# Altium schematic sheet MCU.SchDoc: Top Level
size A3; CompanyName: NOT USED; SheetNumber: 0; SheetTotal: 0; PageSetup: Record=PageOptions|CenterHorizontal=True|CenterVertical=True|PrintScale=1.00|XCorrection=1.00|YCorrection=1.00|PrintKind=0|BorderSize=5000000|LeftOffset=0|BottomOffset=0|Orientation=2|PaperLength=1000|PaperWidth=1000|Scale=100|PaperSource=7|PrintQuality=-4|MediaType=1|DitherType=10|PaperKind=A3|PrintScaleMode=0
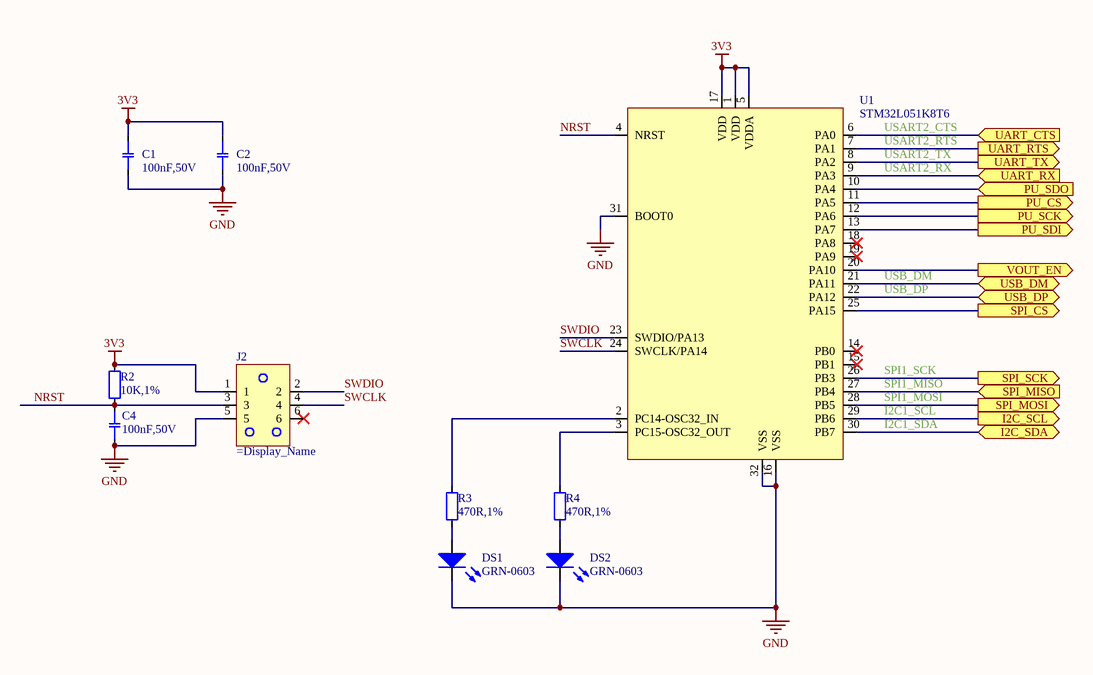
[diagram p0: MCU.SchDoc]

## Parts
C1  100nF,50V  [CAPC1608X09N_0603]
C2  100nF,50V  [CAPC1608X09N_0603]
C4  100nF,50V  [CAPC1608X09N_0603]
DS1  GRN-0603  [LED_SML-LX0603]
DS2  GRN-0603  [LED_SML-LX0603]
J2  (no value)  [TAG-CONNECT_TC2030-IDC]  (no BOM)
R2  10K,1%  [RESC1608X06N_0603]
R3  470R,1%  [RESC1608X06N_0603]
R4  470R,1%  [RESC1608X06N_0603]
U1  STM32L051K8T6  [LQFP32]

## Ports
I2C_SCL (out), I2C_SDA (bidir), PU_CS (out), PU_SCK (out), PU_SDI (out), PU_SDO (in), SPI_CS (out), SPI_MISO (in), SPI_MOSI (out), SPI_SCK (out), UART_CTS (in), UART_RTS (out), UART_RX (in), UART_TX (out), USB_DM (bidir), USB_DP (bidir), VOUT_EN (out)

## Nets
3V3: C1.2 C2.2 J2.1 R2.2 U1.1(VDD) U1.5(VDDA) U1.17(VDD)
GND: C1.1 C2.1 C4.2 DS1.1(C) DS2.1(C) J2.5 U1.16(VSS) U1.31(BOOT0) U1.32(VSS)
I2C_SCL: U1.29(PB6) ; port I2C_SCL
I2C_SDA: U1.30(PB7) ; port I2C_SDA
NRST: C4.1 J2.3 R2.1 U1.4(NRST)
PU_CS: U1.11(PA5) ; port PU_CS
PU_SCK: U1.12(PA6) ; port PU_SCK
PU_SDI: U1.13(PA7) ; port PU_SDI
PU_SDO: U1.10(PA4) ; port PU_SDO
SPI_CS: U1.25(PA15) ; port SPI_CS
SPI_MISO: U1.27(PB4) ; port SPI_MISO
SPI_MOSI: U1.28(PB5) ; port SPI_MOSI
SPI_SCK: U1.26(PB3) ; port SPI_SCK
SWCLK: J2.4 U1.24(SWCLK/PA14)
SWDIO: J2.2 U1.23(SWDIO/PA13)
UART_CTS: U1.6(PA0) ; port UART_CTS
UART_RTS: U1.7(PA1) ; port UART_RTS
UART_RX: U1.9(PA3) ; port UART_RX
UART_TX: U1.8(PA2) ; port UART_TX
USB_DM: U1.21(PA11) ; port USB_DM
USB_DP: U1.22(PA12) ; port USB_DP
VOUT_EN: U1.20(PA10) ; port VOUT_EN
NetDS1_2: DS1.2(A) R3.1
NetDS2_2: DS2.2(A) R4.1
NetR3_2: R3.2 U1.2(PC14-OSC32_IN)
NetR4_2: R4.2 U1.3(PC15-OSC32_OUT)

Not connected (* = marked no-connect by the designer): J2 6*; U1 14(PB0)* 15(PB1)* 18(PA8)* 19(PA9)*

## Notes on the sheet
- (near U1) USART2_CTS
- (near U1) USART2_RTS
- (near U1) USART2_TX
- (near U1) USART2_RX
- (near U1) USB_DM
- (near U1) USB_DP
- (near U1) SPI1_SCK
- (near U1) SPI1_MISO
- (near U1) SPI1_MOSI
- (near U1) I2C1_SCL
- (near U1) I2C1_SDA
- Project
- Size:
- Date:
- A3
- Revision:
- Sheet
- of
- Lambo
- File:

## Library data of the parts
C1 C2 C4 = CCH-104CH-G: CAP CER 0.1UF 50V 10% X7R 0603; Manufacturer: Kemet; Manufacturer Part Number: C0603C104K5RACTU; Type: Ceramic; Display_Name: 100nF,50V; Capacitance: 100nF; Dielectric: X7R; Tolerance: 10%; Voltage: 50V; BWA PN: CCH-104CH-G; Schematic Symbol: CAP-NP_1; Supplier 1: Digi-Key; Supplier Part Number 1: 399-5089-1-ND
DS1 DS2 = LED-10087-A: LED GREEN CLEAR 0603 SMD; Manufacturer: Dialight; Manufacturer Part Number: 5988081107F; Wavelength: 523nm; Axial Intensity: 300mcd; If(max): 20mA; Lens Style/Size: 0603; Vf@I: 3.2V; Viewing Angle: 140; Display_Name: GRN-0603; BWA PN: LED-10087-A; Colour: GREEN; Lens type: clear; Vr(max): -; Schematic Symbol: LED_1; Supplier 1: Digi-Key; Supplier Part Number 1: 350-2036-1-ND
J2 = NONPART-051: Tag connect 6 way; Schematic Symbol: TAGCON_TC2030-IDC; BWA PN: NONPART-051
R2 = RSH-10K00-D: RES 10.0K OHM 1/10W 1% 0603 SMD; Manufacturer: Yageo; Manufacturer Part Number: RC0603FR-0710KL; Power: 0.1W; Display_Name: 10K,1%; Resistance: 10K; Tolerance: 1%; Type: Chip; BWA PN: RSH-10K00-D; Schematic Symbol: RESISTOR_1; Supplier 1: Digi-Key; Supplier Part Number 1: 311-10.0KHRCT-ND
R3 R4 = RSH-470R0-D: RES 470 OHM 1/10W 1% 0603 SMD; Manufacturer: Rohm Semiconductor; Manufacturer Part Number: MCR03EZPFX4700; Power: 0.1W; Display_Name: 470R,1%; Resistance: 470R; Tolerance: 1%; Type: Chip; BWA PN: RSH-470R0-D; Schematic Symbol: RESISTOR_1; Supplier 1: Digi-Key; Supplier Part Number 1: RHM470HCT-ND
U1 = ICT-10696-A: 32 Bit Mcirocontroler; Manufacturer: ST Microelectronics; Temp Range: -40°C ~ 85°C; Display_Name: STM32L051K8T6; BWA PN: ICT-10696-A; Schematic Symbol: STM32L051x6/8; Manufacturer Part Number: STM32L051K8T6; Supplier 1: Digi-Key; Supplier Part Number 1: 497-14901-ND